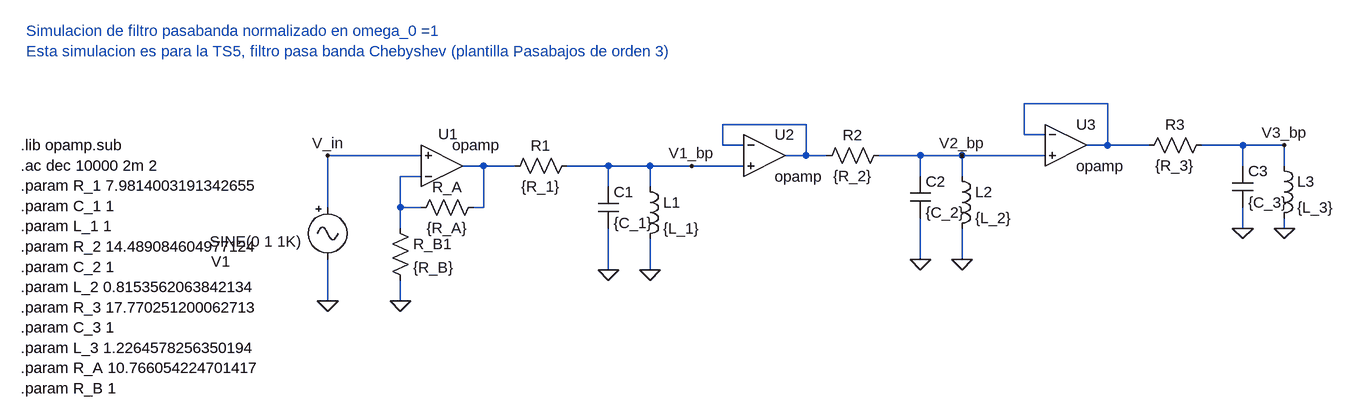
[diagram p0: schematic ts5_bp.asc]
ts5_bp.asc, the LTspice schematic file:
Version 4
SHEET 1 1780 1008
WIRE 1184 160 1056 160
WIRE 720 192 592 192
WIRE 1056 208 1056 160
WIRE 1088 208 1056 208
WIRE 592 224 592 192
WIRE 624 224 592 224
WIRE 1184 224 1184 160
WIRE 1184 224 1152 224
WIRE 1248 224 1184 224
WIRE 1392 224 1328 224
WIRE 1456 224 1392 224
WIRE 128 240 -16 240
WIRE 720 240 720 192
WIRE 720 240 688 240
WIRE 752 240 720 240
WIRE 896 240 832 240
WIRE 960 240 896 240
WIRE 1088 240 960 240
WIRE 224 256 192 256
WIRE 272 256 224 256
WIRE 416 256 352 256
WIRE 480 256 416 256
WIRE 544 256 480 256
WIRE 624 256 544 256
WIRE 1392 256 1392 224
WIRE 1456 256 1456 224
WIRE 128 272 96 272
WIRE 896 272 896 240
WIRE 960 272 960 240
WIRE 416 288 416 256
WIRE 480 288 480 256
WIRE -16 320 -16 240
WIRE 96 320 96 272
WIRE 128 320 96 320
WIRE 224 320 224 256
WIRE 224 320 208 320
WIRE 96 352 96 320
WIRE 1392 352 1392 320
WIRE 1456 352 1456 336
WIRE 896 400 896 336
WIRE 960 400 960 352
WIRE 416 416 416 352
WIRE 480 416 480 368
WIRE -16 464 -16 400
WIRE 96 464 96 432
FLAG 416 416 0
FLAG 480 416 0
FLAG -16 464 0
FLAG 544 256 V1_bp
FLAG 96 464 0
FLAG 896 400 0
FLAG 960 400 0
FLAG 960 240 V2_bp
FLAG 1392 352 0
FLAG 1456 352 0
FLAG 1456 224 V3_bp
FLAG -16 240 V_in
SYMBOL res 368 240 R90
WINDOW 0 0 56 VBottom 2
WINDOW 3 32 56 VTop 2
SYMATTR InstName R1
SYMATTR Value {R_1}
SYMBOL cap 400 288 R0
SYMATTR InstName C1
SYMATTR Value {C_1}
SYMBOL ind 464 272 R0
SYMATTR InstName L1
SYMATTR Value {L_1}
SYMBOL Misc/signal -16 304 R0
WINDOW 0 -179 99 Left 2
WINDOW 3 -181 68 Left 2
SYMATTR InstName V1
SYMATTR Value2 AC 1
SYMBOL Opamps/opamp 160 320 M180
WINDOW 0 -6 113 Left 2
SYMATTR InstName U1
SYMBOL res 80 336 R0
SYMATTR InstName R_B1
SYMATTR Value {R_B}
SYMBOL res 224 304 R90
WINDOW 0 0 56 VBottom 2
WINDOW 3 32 56 VTop 2
SYMATTR InstName R_A
SYMATTR Value {R_A}
SYMBOL res 848 224 R90
WINDOW 0 0 56 VBottom 2
WINDOW 3 32 56 VTop 2
SYMATTR InstName R2
SYMATTR Value {R_2}
SYMBOL cap 880 272 R0
SYMATTR InstName C2
SYMATTR Value {C_2}
SYMBOL ind 944 256 R0
SYMATTR InstName L2
SYMATTR Value {L_2}
SYMBOL res 1344 208 R90
WINDOW 0 0 56 VBottom 2
WINDOW 3 32 56 VTop 2
SYMATTR InstName R3
SYMATTR Value {R_3}
SYMBOL ind 1440 240 R0
SYMATTR InstName L3
SYMATTR Value {L_3}
SYMBOL cap 1376 256 R0
SYMATTR InstName C3
SYMATTR Value {C_3}
SYMBOL Opamps/opamp 656 176 R0
SYMATTR InstName U2
SYMBOL Opamps/opamp 1120 160 R0
SYMATTR InstName U3
TEXT -488 224 Left 2 !.lib opamp.sub\n.ac dec 10000 2m 2\n.param R_1 7.9814003191342655\n.param C_1 1\n.param L_1 1\n.param R_2 14.489084604977124\n.param C_2 1\n.param L_2 0.8153562063842134\n.param R_3 17.770251200062713\n.param C_3 1\n.param L_3 1.2264578256350194\n.param R_A 10.766054224701417\n.param R_B 1
TEXT -480 48 Left 2 ;Simulacion de filtro pasabanda normalizado en omega_0 =1\nEsta simulacion es para la TS5, filtro pasa banda Chebyshev (plantilla Pasabajos de orden 3)

The netlist it stands for:
* ts5_bp.asc
R1 V1_bp N003 {R_1}
C1 V1_bp 0 {C_1}
L1 V1_bp 0 {L_1}
V1 V_in 0 SINE(0 1 1K) AC 1
XU1 N004 V_in N003 opamp Aol=100K GBW=10Meg  ; pins invin noninvin out
R_B1 N004 0 {R_B}
R_A N003 N004 {R_A}
R2 V2_bp N002 {R_2}
C2 V2_bp 0 {C_2}
L2 V2_bp 0 {L_2}
R3 V3_bp N001 {R_3}
L3 V3_bp 0 {L_3}
C3 V3_bp 0 {C_3}
XU2 N002 V1_bp N002 opamp Aol=100K GBW=10Meg  ; pins invin noninvin out
XU3 N001 V2_bp N001 opamp Aol=100K GBW=10Meg  ; pins invin noninvin out
.lib opamp.sub
.ac dec 10000 2m 2
.param R_1 7.9814003191342655
.param C_1 1
.param L_1 1
.param R_2 14.489084604977124
.param C_2 1
.param L_2 0.8153562063842134
.param R_3 17.770251200062713
.param C_3 1
.param L_3 1.2264578256350194
.param R_A 10.766054224701417
.param R_B 1
* Simulacion de filtro pasabanda normalizado en omega_0 =1
* Esta simulacion es para la TS5, filtro pasa banda Chebyshev (plantilla Pasabajos de orden 3)
.backanno
.end